# EasyEDA schematic 1-Schematic_Mailbox_Sensor_eLab.json
TITLE: Mailbox Sensor; REV: 1.0; Date: 2024-04-21; Sheet: 1/1; Drawn By: harrismujib12; Company: SiGen
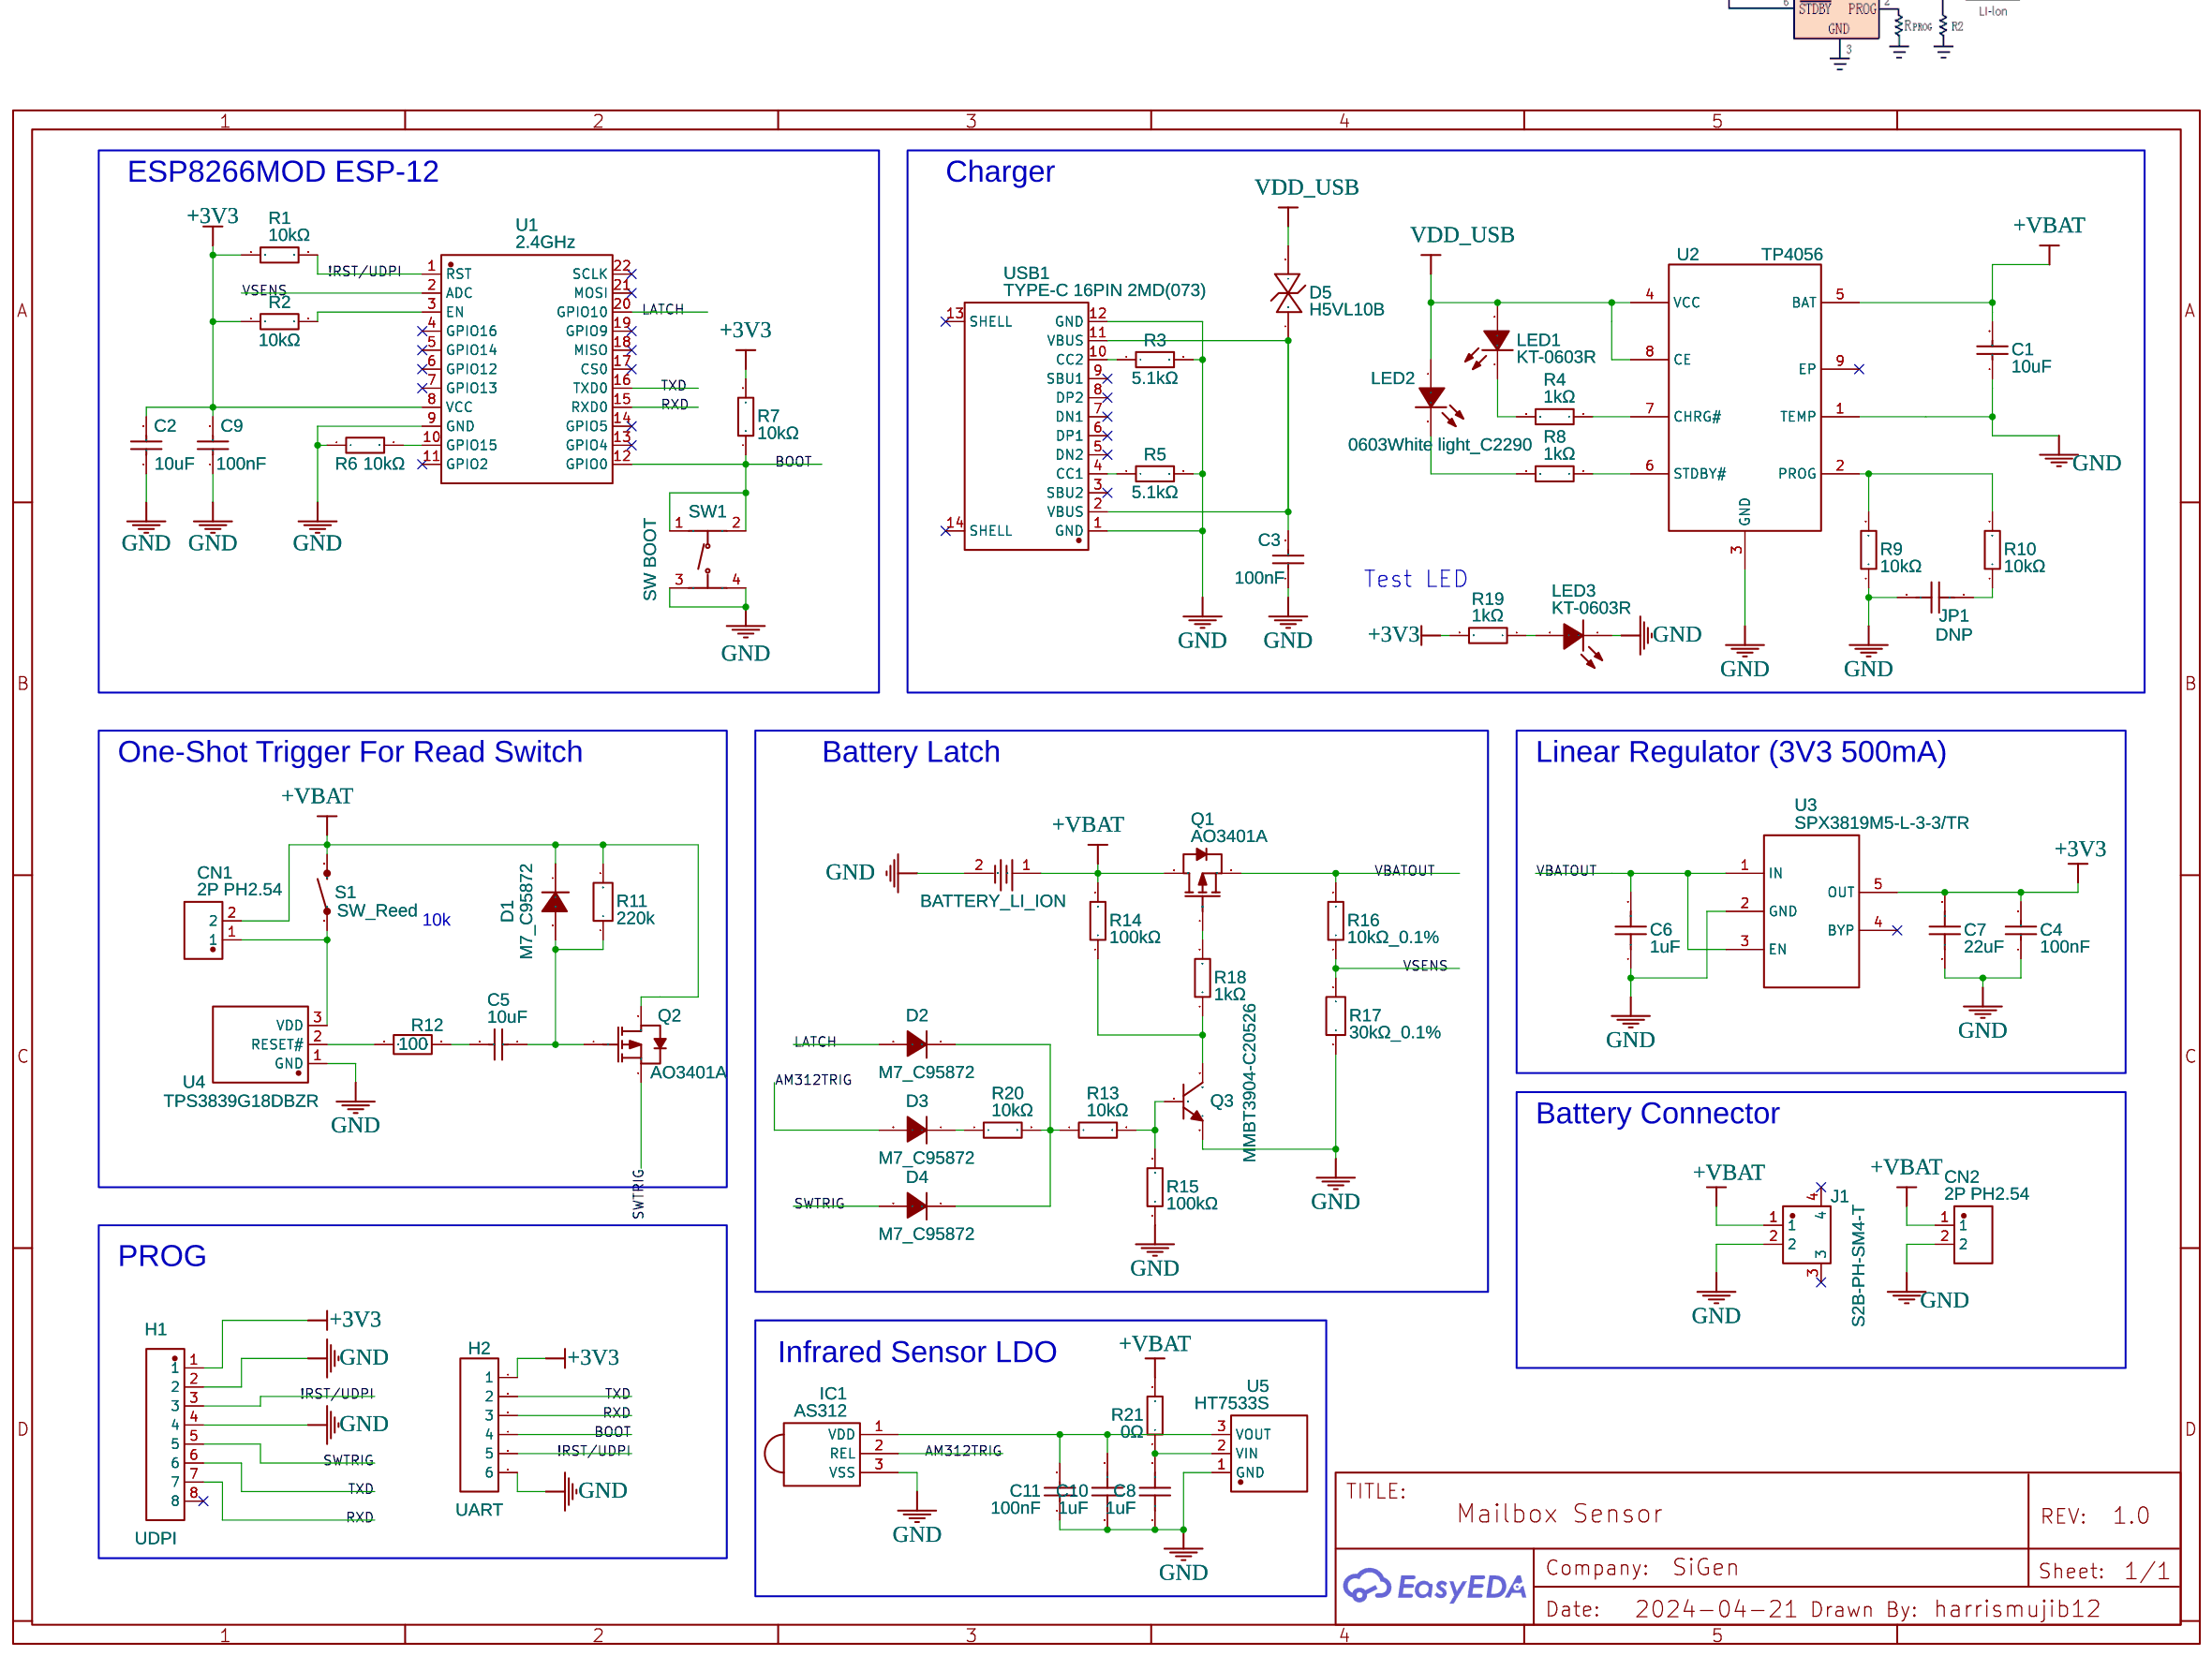
[diagram p0: schematic sheet]

## Parts
BATTERY_LI_ION  CR1220-2  [BAT-TH_KEYSTONE-1028]
C1  10uF  [C0402]
C2  10uF  [C0402]
C3  100nF  [C0402]
C4  100nF  [C0402]
C5  10uF  [C0402]
C6  1uF  [C0402]
C7  22uF  [C0603]
C8  1uF  [C0402]
C9  100nF  [C0402]
C10  1uF  [C0402]
C11  100nF  [C0402]
CN1  2P PH2.54  [CONN-TH_2P-P2.54_HDR2]
CN2  2P PH2.54  [CONN-TH_2P-P2.54_HDR2]
D1  M7_C95872  [DO-214AC_L4.3-W2.7-LS5.3-RD]
D2  M7_C95872  [DO-214AC_L4.3-W2.7-LS5.3-RD]
D3  M7_C95872  [DO-214AC_L4.3-W2.7-LS5.3-RD]
D4  M7_C95872  [DO-214AC_L4.3-W2.7-LS5.3-RD]
D5  H5VL10B  [SOD-882_L1.0-W0.6-BI]
H1  UDPI  [HDR-TH_8P-P2.54-V-M]
H2  UART  [HDR-TH_6P-P2.54-V-M-1]
IC1  AS312  [SENSORM-TH_3P_AS312]
J1  S2B-PH-SM4-T  [CONN-SMD_P2.00_S2B-PH-SM4-TB-LF-SN]
JP1  DNP  [C0402]
LED1  KT-0603R  [LED0603-RD]
LED2  0603White light_C2290  [LED0603-R-RD_WHITE]
LED3  KT-0603R  [LED0603-RD]
Q1  AO3401A  [SOT-23_L2.9-W1.3-P1.90-LS2.4-BR]
Q2  AO3401A  [SOT-23_L2.9-W1.3-P1.90-LS2.4-BR]
Q3  MMBT3904-C20526  [SOT-23-3_L2.9-W1.3-P1.90-LS2.4-BR]
R1  10kΩ  [R0402]
R2  10kΩ  [R0402]
R3  5.1kΩ  [R0402]
R4  1kΩ  [R0402]
R5  5.1kΩ  [R0402]
R6  10kΩ  [R0402]
R7  10kΩ  [R0402]
R8  1kΩ  [R0402]
R9  10kΩ  [R0402]
R10  10kΩ  [R0402]
R11  220k  [R0603]
R12  100  [R0603]
R13  10kΩ  [R0402]
R14  100kΩ  [R0603]
R15  100kΩ  [R0603]
R16  10kΩ_0.1%  [R0402]
R17  30kΩ_0.1%  [R0402]
R18  1kΩ  [R0402]
R19  1kΩ  [R0402]
R20  10kΩ  [R0402]
R21  0Ω  [R0402]
S1  SW_Reed  [REED_SWITCH_PTH]
SW1  SW BOOT  [SW-SMD_4P-L5.1-W5.1-P3.70-LS6.5-TL-2]
U1  2.4GHz  [WIFIM-SMD_ESP-12F-ESP8266MOD]
U2  TP4056  [ESOP-8_L4.9-W3.9-P1.27-LS6.0-BL-EP]
U3  SPX3819M5-L-3-3/TR  [SOT-23-5_L3.0-W1.7-P0.95-LS2.8-BL]
U4  TPS3839G18DBZR  [SOT-23-3_L2.9-W1.3-P1.90-LS2.6-BR]
U5  HT7533S  [SOT-23-3_L2.9-W1.5-P1.90-LS2.8-BR-CW]
USB1  TYPE-C 16PIN 2MD(073)  [USB-C-SMD_TYPE-C-6PIN-2MD-073]

## Library data of the parts
BATTERY_LI_ION = CR1220-2: Supplier: LCSC; Manufacturer: Q&J; image: //image.lceda.cn/szlcsc/C70381.jpg; Supplier Part: C70381
C1 C2 C5 = CL05A106MQ5NUNC: Supplier: LCSC; Manufacturer: SAMSUNG(三星); Supplier Part: C15525; JLCPCB Part Class: Basic Part
C3 C4 C9 C11 = CL05B104KO5NNNC: Supplier: LCSC; Manufacturer: SAMSUNG(三星); Supplier Part: C1525; JLCPCB Part Class: Basic Part
C6 C8 C10 = CL05A105KA5NQNC: Supplier: LCSC; Manufacturer: SAMSUNG(三星); Supplier Part: C52923; JLCPCB Part Class: Basic Part
C7 = CL10A226MQ8NRNC: Supplier: LCSC; Manufacturer: SAMSUNG(三星); Supplier Part: C59461; JLCPCB Part Class: Basic Part
CN1 CN2 = 2P PH2.54: Contributor: LCSC; Supplier: LCSC; Supplier Part: C9900006197; JLCPCB Part Class: Extended Part
D1-D4 = M7_C95872: Supplier: LCSC; Manufacturer: MDD; Manufacturer Part: M7; Supplier Part: C95872; SMT Type: Basic; JLCPCB SMD: Yes; Contributor: yuminet
D5 = H5VL10B: Supplier: LCSC; Supplier Part: C7420372; Manufacturer: 宏迦橙; Contributor: lcsc; JLCPCB Part Class: Extended Part; Package Display: No
H1 = PZ254V-11-08P: Contributor: LCSC; Supplier: LCSC; Supplier Part: C492407; Manufacturer: XFCN(兴飞); JLCPCB Part Class: Extended Part
H2 = Header-Male-2.54_1x6: Supplier: LCSC; Manufacturer: BOOMELE(博穆精密); Manufacturer Part: 2.54-1x6P直针; Supplier Part: C37208; JLCPCB Part Class: Extended Part
IC1 = AS312: Supplier: LCSC; Manufacturer: 森霸; Supplier Part: C90465; JLCPCB Part Class: Extended Part
J1 = S2B-PH-SM4-TB(LF)(SN): Contributor: daniel.machado.azevedo.junior; Supplier: LCSC; Supplier Part: C295747; Manufacturer: JST; JLCPCB Part Class: Extended Part
JP1 = CQ0402ARNPO0BN1R0: Contributor: lcsc; Supplier: LCSC; Supplier Part: C5182443; Manufacturer: YAGEO(国巨)
LED1 LED3 = KT-0603R: Supplier: LCSC; Manufacturer: KENTO; Supplier Part: C2286; JLCPCB Part Class: Basic Part
LED2 = 0603White light_C2290: Supplier: LCSC; Manufacturer: KENTO; Manufacturer Part: KT-0603白灯; Supplier Part: C2290; JLCPCB Part Class: Basic Part
Q1 Q2 = AO3401A: Supplier: LCSC; Manufacturer: AOS; Supplier Part: C15127; JLCPCB Part Class: Basic Part; Contributor: mingoblox
Q3 = MMBT3904-C20526: Supplier: LCSC; Manufacturer: CJ; Manufacturer Part: MMBT3904; Supplier Part: C20526; Contributor: young kim; Paste Type: base
R1 R2 R6 R7 R9 R10 R13 R20 = 0402WGF1002TCE: Supplier: LCSC; Manufacturer: UNI-ROYAL(厚声); Supplier Part: C25744; JLCPCB Part Class: Basic Part
R3 R5 = 0402WGF5101TCE: Supplier: LCSC; Manufacturer: UNI-ROYAL(厚声); Supplier Part: C25905; JLCPCB Part Class: Basic Part
R4 R8 R18 R19 = 0402WGF1001TCE: Supplier: LCSC; Manufacturer: UNI-ROYAL(厚声); Supplier Part: C11702; JLCPCB Part Class: Basic Part
R11 R12 = R_0603_EU: Contributor: LCEDA_Lib
R14 R15 = 0603WAF1003T5E: Supplier: LCSC; Manufacturer: UNI-ROYAL(厚声); Supplier Part: C25803; JLCPCB Part Class: Basic Part
R16 = RT0402BRD0710KL: Contributor: LCSC; Supplier: LCSC; Supplier Part: C190095; Manufacturer: YAGEO(国巨); JLCPCB Part Class: Extended Part
R17 = RT0402BRD0730KL: Supplier: LCSC; Supplier Part: C728558; Manufacturer: YAGEO(国巨); JLCPCB Part Class: Extended Part; Contributor: lcsc
R21 = 0402WGJ0000TCE: Supplier: LCSC; Manufacturer: UNI-ROYAL(厚声); Supplier Part: C21376; JLCPCB Part Class: Extended Part; Package Display: No
S1 = SWITCH-MOMENTARYPTH_REED: Contributor: Pinoccio
SW1 = TS-1187A-B-A-B: Contributor: LCSC; Supplier: LCSC; Supplier Part: C318884; Manufacturer: XKB Connectivity(中国星坤); JLCPCB Part Class: Basic Part
U1 = ESP-12F(ESP8266MOD): Supplier: LCSC; Manufacturer: Ai-Thinker(安信可); Supplier Part: C82891; JLCPCB Part Class: Extended Part
U2 = TP4056: Contributor: Guest; Supplier: LCSC; Manufacturer: TOPPOWER(南京拓微); Manufacturer Part: TP4056-42-ESOP8; Supplier Part: C16581; JLCPCB Part Class: Extended Part
U3 = SPX3819M5-L-3-3/TR: Supplier: LCSC; Manufacturer: MaxLinear; Supplier Part: C9055; JLCPCB Part Class: Extended Part; Contributor: MiteaDan
U4 = TPS3839G18DBZR: Contributor: lcsc; Supplier: LCSC; Supplier Part: C544505; Manufacturer: TI(德州仪器); JLCPCB Part Class: Extended Part
U5 = HT7533S: Contributor: LCSC; Supplier: LCSC; Supplier Part: C347215; Manufacturer: UMW(友台半导体); JLCPCB Part Class: Extended Part
USB1 = TYPE-C 16PIN 2MD(073): Contributor: LCSC; Supplier: LCSC; Supplier Part: C2765186; Manufacturer: SHOU HAN(首韩); JLCPCB Part Class: Extended Part

## Nets
+3V3: C2.2 C4.2 C7.2 C9.2 H1.1 H2.1 R1.1 R2.1 R7.2 R19.2 U1.8(VCC) U3.5(OUT)
+VBAT: BATTERY_LI_ION.1 C1.2 CN1.2 CN2.1 D1.1(K) J1.1 Q1.3(D) Q2.3(D) R11.2 R14.2 R21.2 S1.P$2(2) U2.5(BAT)
GND: BATTERY_LI_ION.2 C1.1 C2.1 C3.1 C4.1 C6.1 C7.1 C8.1 C9.1 C10.1 C11.1 CN2.2 H1.2 H1.4 H2.6 IC1.3(VSS) J1.2 JP1.2 LED3.1(K) Q3.2(E) R3.2 R5.2 R6.1 R9.1 R15.1 R17.1 SW1.3(C) SW1.4(D) U1.9(GND) U2.1(TEMP) U2.3(GND) U3.2(GND) U4.1(GND) U5.1(GND) USB1.1(GND) USB1.12(GND)
VBATOUT: C6.2 Q1.2(S) R16.2 U3.1(IN) U3.3(EN)
VDD_USB: D5.2(A) LED1.2(A) LED2.1(A) U2.4(VCC) U2.8(CE)
!RST/UDPI: H1.3 H2.5 R1.2 U1.1(RST)
AM312TRIG: D3.2(A) IC1.2(REL)
BOOT: H2.4 R7.1 SW1.1(A) SW1.2(B) U1.12(GPIO0)
LATCH: D2.2(A) U1.20(GPIO10)
RXD: H1.7 H2.3 U1.15(RXD0)
SWTRIG: D4.2(A) H1.5 Q2.2(S)
TXD: H1.6 H2.2 U1.16(TXD0)
VSENS: R16.1 R17.2 U1.2(ADC)
Net-(C3-2): C3.2 D5.1(C) USB1.2(VBUS) USB1.11(VBUS)
Net-(C5-1): C5.1 D1.2(A) Q2.1(G) R11.1
Net-(C5-2): C5.2 R12.2
Net-(C8-2): C8.2 R21.1 U5.2(VIN)
Net-(C10-2): C10.2 C11.2 IC1.1(VDD) U5.3(VOUT)
Net-(CN1-1): CN1.1 S1.P$1(1) U4.3(VDD)
Net-(D2-1): D2.1(K) D4.1(K) R13.1 R20.2
Net-(D3-1): D3.1(K) R20.1
Net-(JP1-1): JP1.1 R10.1
Net-(LED1-1): LED1.1(K) R4.2
Net-(LED2-2): LED2.2(K) R8.2
Net-(LED3-2): LED3.2(A) R19.1
Net-(Q1-1): Q1.1(G) R18.2
Net-(Q3-1): Q3.1(B) R13.2 R15.2
Net-(Q3-3): Q3.3(C) R14.1 R18.1
Net-(R2-2): R2.2 U1.3(EN)
Net-(R3-1): R3.1 USB1.10(CC2)
Net-(R4-1): R4.1 U2.7(CHRG#)
Net-(R5-1): R5.1 USB1.4(CC1)
Net-(R6-2): R6.2 U1.10(GPIO15)
Net-(R8-1): R8.1 U2.6(STDBY#)
Net-(R9-2): R9.2 R10.2 U2.2(PROG)
Net-(R12-1): R12.1 U4.2(RESET#)

Not connected (* = marked no-connect by the designer): H1 8*; J1 3* 4*; U1 4(GPIO16)* 5(GPIO14)* 6(GPIO12)* 7(GPIO13)* 11(GPIO2)* 13(GPIO4)* 14(GPIO5)* 17(CS0)* 18(MISO)* 19(GPIO9)* 21(MOSI)* 22(SCLK)*; U2 9(EP)*; U3 4(BYP)*; USB1 3(SBU2)* 5(DN2)* 6(DP1)* 7(DN1)* 8(DP2)* 9(SBU1)* 13(SHELL)* 14(SHELL)*

## Notes on the sheet
- ESP8266MOD ESP-12
- Charger
- Test LED
- One-Shot Trigger For Read Switch
- Battery Latch
- Linear Regulator (3V3 500mA)
- 10k
- Battery Connector
- PROG
- Infrared Sensor LDO
